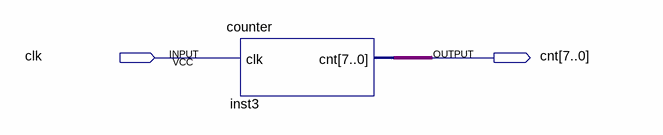
[diagram p0: schematic sheet]
// Quartus schematic Block2.bdf as structural Verilog: 1 symbols, 2 pins
module Block2 (
  input  clk,
  output [7:0] cnt
);

  counter inst3 (.clk(clk), .cnt(cnt));
endmodule
